# Altium schematic sheet Flight_Controller.SchDoc
size A2
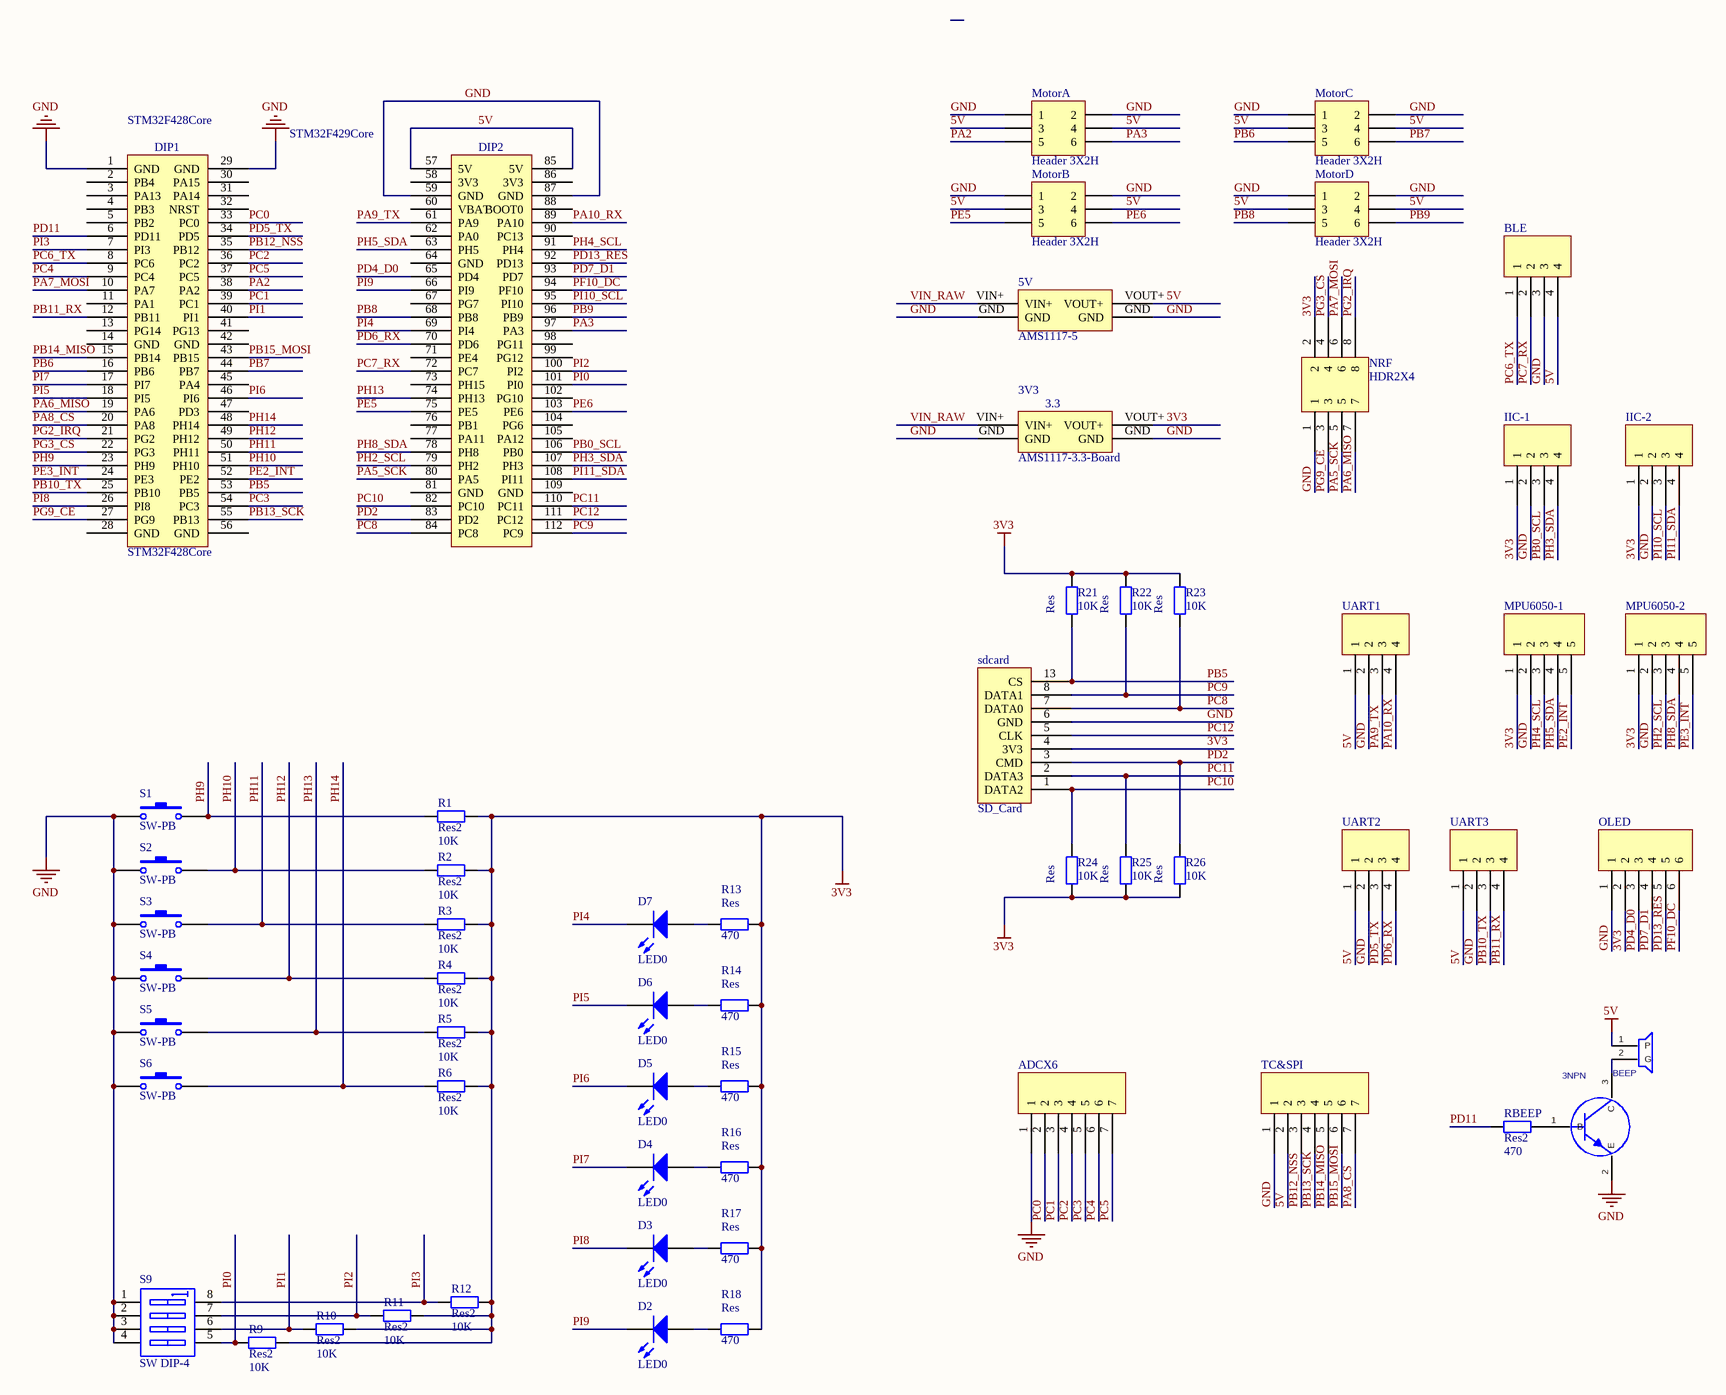
[diagram p0: Flight_Controller.SchDoc]

## Parts
3NPN  NPN  [3NPN]  (value not drawn)
3V3  AMS1117-3.3-Board  [AMS1117-3.3-Board]
5V  AMS1117-5  [AMS1117-5-Board - duplicate]
ADCX6  HDR1X7  [HDR1X7]  (value not drawn)
BEEP  BEEP-9.5X5.5  [BUZZER]  (value not drawn)
BLE  HDR1X4  [HDR1X4]  (value not drawn)
D2  LED0  [0805LED]
D3  LED0  [0805LED]
D4  LED0  [0805LED]
D5  LED0  [0805LED]
D6  LED0  [0805LED]
D7  LED0  [0805LED]
IIC-1  HDR1X4  [HDR1X4]  (value not drawn)
IIC-2  HDR1X4  [HDR1X4]  (value not drawn)
MotorA  Header 3X2H  [HDR2X3]
MotorB  Header 3X2H  [HDR2X3]
MotorC  Header 3X2H  [HDR2X3]
MotorD  Header 3X2H  [HDR2X3]
MPU6050-1  HDR1X5  [HDR1X5]  (value not drawn)
MPU6050-2  HDR1X5  [HDR1X5]  (value not drawn)
NRF  HDR2X4  [HDR2X4]
OLED  HDR1X6  [HDR1X6]  (value not drawn)
R1  Res2  value 10K  [0805]
R2  Res2  value 10K  [0805]
R3  Res2  value 10K  [0805]
R4  Res2  value 10K  [0805]
R5  Res2  value 10K  [0805]
R6  Res2  value 10K  [0805]
R9  Res2  value 10K  [0805]
R10  Res2  value 10K  [0805]
R11  Res2  value 10K  [0805]
R12  Res2  value 10K  [0805]
R13  470  [0805]
R14  470  [0805]
R15  470  [0805]
R16  470  [0805]
R17  470  [0805]
R18  470  [0805]
R21  10K  [0805]
R22  10K  [0805]
R23  10K  [0805]
R24  10K  [0805]
R25  10K  [0805]
R26  10K  [0805]
RBEEP  Res2  value 470  [0805]
S1  SW-PB  [Button]
S2  SW-PB  [Button]
S3  SW-PB  [Button]
S4  SW-PB  [Button]
S5  SW-PB  [Button]
S6  SW-PB  [Button]
S9  SW DIP-4  [bmkgtp]
sdcard  SD_Card  [SD_Card]
STM32F428Core  STM32F428Core  [F429]
TC&SPI  HDR1X7  [HDR1X7]  (value not drawn)
UART1  HDR1X4  [HDR1X4]  (value not drawn)
UART2  HDR1X4  [HDR1X4]  (value not drawn)
UART3  HDR1X4  [HDR1X4]  (value not drawn)

## Nets
3V3: 3V3.VOUT+ IIC-1.1 IIC-2.1 MPU6050-1.1 MPU6050-2.1 NRF.2 OLED.2 R1.2 R2.2 R3.2 R4.2 R5.2 R6.2 R9.2 R10.2 R11.2 R12.2 R13.2 R14.2 R15.2 R16.2 R17.2 R18.2 R21.2 R22.2 R23.2 R24.1 R25.1 R26.1 sdcard.4(3V3)
5V: 5V.VOUT+ BEEP.1(P) BLE.4 MotorA.3 MotorA.4 MotorB.3 MotorB.4 MotorC.3 MotorC.4 MotorD.3 MotorD.4 STM32F428Core.57(5V) STM32F428Core.85(5V) TC&SPI.2 UART1.1 UART2.1 UART3.1
GND: 3NPN.2(E) 3V3.GND 5V.GND ADCX6.1 BLE.3 IIC-1.2 IIC-2.2 MotorA.1 MotorA.2 MotorB.1 MotorB.2 MotorC.1 MotorC.2 MotorD.1 MotorD.2 MPU6050-1.2 MPU6050-2.2 NRF.1 OLED.1 S1.1 S2.1 S3.1 S4.1 S5.1 S6.1 S9.1(A1) S9.2(A2) S9.3(A3) S9.4(A4) sdcard.6(GND) STM32F428Core.1(GND) STM32F428Core.29(GND) STM32F428Core.59(GND) STM32F428Core.87(GND) TC&SPI.1 UART1.2 UART2.2 UART3.2
PA2: MotorA.5 STM32F428Core.38(PA2)
PA3: MotorA.6 STM32F428Core.97(PA3)
PA5_SCK: NRF.5 STM32F428Core.80(PA5)
PA6_MISO: NRF.7 STM32F428Core.19(PA6)
PA7_MOSI: NRF.6 STM32F428Core.10(PA7)
PA8_CS: STM32F428Core.20(PA8) TC&SPI.7
PA9_TX: STM32F428Core.61(PA9) UART1.3
PA10_RX: STM32F428Core.89(PA10) UART1.4
PB0_SCL: IIC-1.3 STM32F428Core.106(PB0)
PB5: R21.1 sdcard.13(CS) STM32F428Core.53(PB5)
PB6: MotorC.5 STM32F428Core.16(PB6)
PB7: MotorC.6 STM32F428Core.44(PB7)
PB8: MotorD.5 STM32F428Core.68(PB8)
PB9: MotorD.6 STM32F428Core.96(PB9)
PB10_TX: STM32F428Core.25(PB10) UART3.3
PB11_RX: STM32F428Core.12(PB11) UART3.4
PB12_NSS: STM32F428Core.35(PB12) TC&SPI.3
PB13_SCK: STM32F428Core.55(PB13) TC&SPI.4
PB14_MISO: STM32F428Core.15(PB14) TC&SPI.5
PB15_MOSI: STM32F428Core.43(PB15) TC&SPI.6
PC0: ADCX6.2 STM32F428Core.33(PC0)
PC1: ADCX6.3 STM32F428Core.39(PC1)
PC2: ADCX6.4 STM32F428Core.36(PC2)
PC3: ADCX6.5 STM32F428Core.54(PC3)
PC4: ADCX6.6 STM32F428Core.9(PC4)
PC5: ADCX6.7 STM32F428Core.37(PC5)
PC6_TX: BLE.1 STM32F428Core.8(PC6)
PC7_RX: BLE.2 STM32F428Core.72(PC7)
PC8: R23.1 sdcard.7(DATA0) STM32F428Core.84(PC8)
PC9: R22.1 sdcard.8(DATA1) STM32F428Core.112(PC9)
PC10: R24.2 sdcard.1(DATA2) STM32F428Core.82(PC10)
PC11: R25.2 sdcard.2(DATA3) STM32F428Core.110(PC11)
PC12: sdcard.5(CLK) STM32F428Core.111(PC12)
PD2: R26.2 sdcard.3(CMD) STM32F428Core.83(PD2)
PD4_D0: OLED.3 STM32F428Core.65(PD4)
PD5_TX: STM32F428Core.34(PD5) UART2.3
PD6_RX: STM32F428Core.70(PD6) UART2.4
PD7_D1: OLED.4 STM32F428Core.93(PD7)
PD11: RBEEP.1 STM32F428Core.6(PD11)
PD13_RES: OLED.5 STM32F428Core.92(PD13)
PE2_INT: MPU6050-1.5 STM32F428Core.52(PE2)
PE3_INT: MPU6050-2.5 STM32F428Core.24(PE3)
PE5: MotorB.5 STM32F428Core.75(PE5)
PE6: MotorB.6 STM32F428Core.103(PE6)
PF10_DC: OLED.6 STM32F428Core.94(PF10)
PG2_IRQ: NRF.8 STM32F428Core.21(PG2)
PG3_CS: NRF.4 STM32F428Core.22(PG3)
PG9_CE: NRF.3 STM32F428Core.27(PG9)
PH2_SCL: MPU6050-2.3 STM32F428Core.79(PH2)
PH3_SDA: IIC-1.4 STM32F428Core.107(PH3)
PH4_SCL: MPU6050-1.3 STM32F428Core.91(PH4)
PH5_SDA: MPU6050-1.4 STM32F428Core.63(PH5)
PH8_SDA: MPU6050-2.4 STM32F428Core.78(PH8)
PH9: R1.1 S1.2 STM32F428Core.23(PH9)
PH10: R2.1 S2.2 STM32F428Core.51(PH10)
PH11: R3.1 S3.2 STM32F428Core.50(PH11)
PH12: R4.1 S4.2 STM32F428Core.49(PH12)
PH13: R5.1 S5.2 STM32F428Core.74(PH13)
PH14: R6.1 S6.2 STM32F428Core.48(PH14)
PI0: R9.1 S9.5(B4) STM32F428Core.101(PI0)
PI1: R10.1 S9.6(B3) STM32F428Core.40(PI1)
PI2: R11.1 S9.7(B2) STM32F428Core.100(PI2)
PI3: R12.1 S9.8(B1) STM32F428Core.7(PI3)
PI4: D7.2(K) STM32F428Core.69(PI4)
PI5: D6.2(K) STM32F428Core.18(PI5)
PI6: D5.2(K) STM32F428Core.46(PI6)
PI7: D4.2(K) STM32F428Core.17(PI7)
PI8: D3.2(K) STM32F428Core.26(PI8)
PI9: D2.2(K) STM32F428Core.66(PI9)
PI10_SCL: IIC-2.3 STM32F428Core.95(PI10)
PI11_SDA: IIC-2.4 STM32F428Core.108(PI11)
VIN_RAW: 3V3.VIN+ 5V.VIN+
Net3NPN_1: 3NPN.1(B) RBEEP.2
Net3NPN_3: 3NPN.3(C) BEEP.2(G)
NetD2_1: D2.1(A) R18.1
NetD3_1: D3.1(A) R17.1
NetD4_1: D4.1(A) R16.1
NetD5_1: D5.1(A) R15.1
NetD6_1: D6.1(A) R14.1
NetD7_1: D7.1(A) R13.1

Not connected (* = marked no-connect by the designer): STM32F428Core 2(PB4) 3(PA13) 4(PB3) 5(PB2) 11(PA1) 13(PG14) 14(GND) 28(GND) 30(PA15) 31(PA14) 32(NRST) 41(PG13) 42(GND) 45(PA4) 47(PD3) 56(GND) 58(3V3) 60(VBAT) 62(PA0) 64(GND) 67(PG7) 71(PE4) 73(PH15) 76(PB1) 77(PA11) 81(GND) 86(3V3) 88(BOOT0) 90(PC13) 98(PG11) 99(PG12) 102(PG10) 104(PG6) 105(PA12) 109(GND)

## Notes on the sheet
- (in symbol AMS1117-3.3-Board) 3.3
- (in symbol res) Res
- (in symbol STM32F428Core) STM32F429Core; DIP1; DIP2

## Library data of the parts
3NPN = 3NPN: PCB DECAL: SOT-23; Manufacturer #2: 8050
D2-D7 = LED0: Typical INFRARED GaAs LED; Published: 8-Jun-2000; LatestRevisionDate: 08-Jul-2005; LatestRevisionNote: Mech Layer 1 removed.; PackageReference: LED-0; Publisher: Altium Limited; PackageDescription: LED; 2 Leads
MotorA MotorB MotorC MotorD = Header 3X2H: Header, 3-Pin, Dual row, Right Angle; LatestRevisionDate: 17-Jul-2002; LatestRevisionNote: Re-released for DXP Platform.; Publisher: Altium Limited
R1-R6 R9-R12 RBEEP = Res2: Resistor; Published: 8-Jun-2000; LatestRevisionDate: 17-Jul-2002; LatestRevisionNote: Re-released for DXP Platform.; PackageReference: AXIAL-0.4; Publisher: Altium Limited; PackageDescription: Axial Device, Thru-Hole; 2 Leads; 0.4 in Pin Spacing
R13-R18 R21-R26 = res
S1-S6 = SW-PB: Switch; Published: 24-Mar-1999; LatestRevisionDate: 17-Jul-2002; LatestRevisionNote: Re-released for DXP Platform.; PackageReference: SPST-2; Publisher: Altium Limited; PackageDescription: Switch; 2 Leads
S9 = SW DIP-4: DIP Switch, 4 Position, SPST; Published: 24-Mar-1999; LatestRevisionDate: 29-May-2009; LatestRevisionNote: IPC-7351 Footprint Added.; PackageVersion: Dec-2002; PackageReference: SO8; Publisher: Altium Limited; PackageDescription: 8-Pin Small Outline Integrated Circuit 1.27 mm Pitch; Code_JEDEC: MS-012-AA; Code_IPC: SOIC127P600-8
BEEP = BEEP-9.5X5.5: PCB DECAL: BEEP-9.5X5.5